# Altium project Driver Controller Tester.PrjPcb
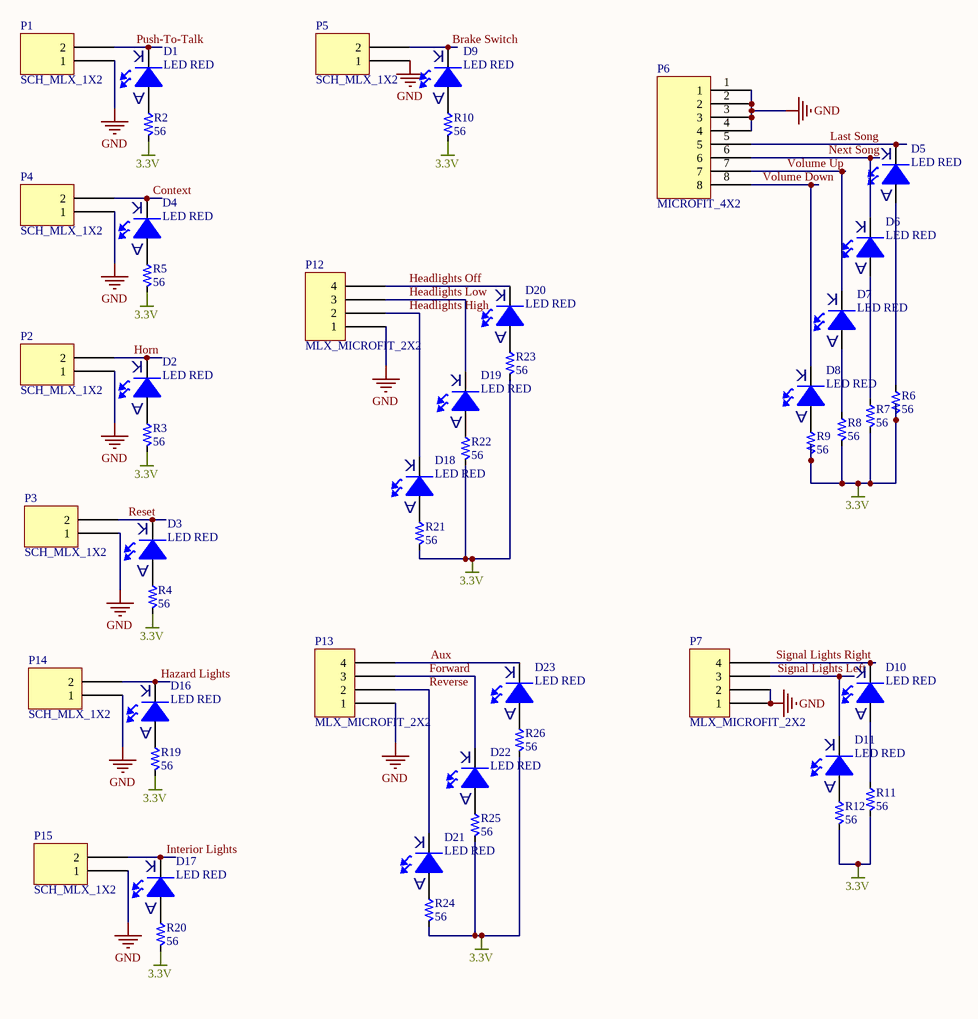
[diagram p0: Connectors.SchDoc]
2 sheets, 69 parts. Net scope: global (net labels, ports and power ports of the same name join across sheets).
Board file: Driver Controller Tester.PcbDoc
Sheets:
  Connectors.SchDoc
  Driver Controller Tester.SchDoc

## Sheet Connectors.SchDoc
size Letter

### Parts
D1  LED RED  [RED LED]
D2  LED RED  [RED LED]
D3  LED RED  [RED LED]
D4  LED RED  [RED LED]
D5  LED RED  [RED LED]
D6  LED RED  [RED LED]
D7  LED RED  [RED LED]
D8  LED RED  [RED LED]
D9  LED RED  [RED LED]
D10  LED RED  [RED LED]
D11  LED RED  [RED LED]
D16  LED RED  [RED LED]
D17  LED RED  [RED LED]
D18  LED RED  [RED LED]
D19  LED RED  [RED LED]
D20  LED RED  [RED LED]
D21  LED RED  [RED LED]
D22  LED RED  [RED LED]
D23  LED RED  [RED LED]
P1  SCH_MLX_1X2  [PCB_MLX_MICROFIT_1X2]
P2  SCH_MLX_1X2  [PCB_MLX_MICROFIT_1X2]
P3  SCH_MLX_1X2  [PCB_MLX_MICROFIT_1X2]
P4  SCH_MLX_1X2  [PCB_MLX_MICROFIT_1X2]
P5  SCH_MLX_1X2  [PCB_MLX_MICROFIT_1X2]
P6  MICROFIT_4X2  [PCB_MLX_MICROFIT_4X2]
P7  MLX_MICROFIT_2X2  [MLX_MICROFIT_2X2]
P12  MLX_MICROFIT_2X2  [MLX_MICROFIT_2X2]
P13  MLX_MICROFIT_2X2  [MLX_MICROFIT_2X2]
P14  SCH_MLX_1X2  [PCB_MLX_MICROFIT_1X2]
P15  SCH_MLX_1X2  [PCB_MLX_MICROFIT_1X2]
R2  Resistance: 56  [PCB_GENERIC_SMD_0603]  (hidden comment: SCH_GENERIC_RESISTOR_0603)
R3  Resistance: 56  [PCB_GENERIC_SMD_0603]  (hidden comment: SCH_GENERIC_RESISTOR_0603)
R4  Resistance: 56  [PCB_GENERIC_SMD_0603]  (hidden comment: SCH_GENERIC_RESISTOR_0603)
R5  Resistance: 56  [PCB_GENERIC_SMD_0603]  (hidden comment: SCH_GENERIC_RESISTOR_0603)
R6  Resistance: 56  [PCB_GENERIC_SMD_0603]  (hidden comment: SCH_GENERIC_RESISTOR_0603)
R7  Resistance: 56  [PCB_GENERIC_SMD_0603]  (hidden comment: SCH_GENERIC_RESISTOR_0603)
R8  Resistance: 56  [PCB_GENERIC_SMD_0603]  (hidden comment: SCH_GENERIC_RESISTOR_0603)
R9  Resistance: 56  [PCB_GENERIC_SMD_0603]  (hidden comment: SCH_GENERIC_RESISTOR_0603)
R10  Resistance: 56  [PCB_GENERIC_SMD_0603]  (hidden comment: SCH_GENERIC_RESISTOR_0603)
R11  Resistance: 56  [PCB_GENERIC_SMD_0603]  (hidden comment: SCH_GENERIC_RESISTOR_0603)
R12  Resistance: 56  [PCB_GENERIC_SMD_0603]  (hidden comment: SCH_GENERIC_RESISTOR_0603)
R19  Resistance: 56  [PCB_GENERIC_SMD_0603]  (hidden comment: SCH_GENERIC_RESISTOR_0603)
R20  Resistance: 56  [PCB_GENERIC_SMD_0603]  (hidden comment: SCH_GENERIC_RESISTOR_0603)
R21  Resistance: 56  [PCB_GENERIC_SMD_0603]  (hidden comment: SCH_GENERIC_RESISTOR_0603)
R22  Resistance: 56  [PCB_GENERIC_SMD_0603]  (hidden comment: SCH_GENERIC_RESISTOR_0603)
R23  Resistance: 56  [PCB_GENERIC_SMD_0603]  (hidden comment: SCH_GENERIC_RESISTOR_0603)
R24  Resistance: 56  [PCB_GENERIC_SMD_0603]  (hidden comment: SCH_GENERIC_RESISTOR_0603)
R25  Resistance: 56  [PCB_GENERIC_SMD_0603]  (hidden comment: SCH_GENERIC_RESISTOR_0603)
R26  Resistance: 56  [PCB_GENERIC_SMD_0603]  (hidden comment: SCH_GENERIC_RESISTOR_0603)

### Nets
3.3V: R2.2 R3.2 R4.2 R5.2 R6.2 R7.2 R8.2 R9.2 R10.2 R11.2 R12.2 R19.2 R20.2 R21.2 R22.2 R23.2 R24.2 R25.2 R26.2
GND: P1.1 P2.1 P3.1 P4.1 P5.1 P6.1 P6.2 P6.3 P6.4 P7.1 P7.2 P12.1 P13.1 P14.1 P15.1
Aux: D23.1 P13.4
Brake Switch: D9.1 P5.2
Context: D4.1 P4.2
Forward: D22.1 P13.3
Hazard Lights: D16.1 P14.2
Headlights High: D18.1 P12.2
Headlights Low: D19.1 P12.3
Headlights Off: D20.1 P12.4
Horn: D2.1 P2.2
Interior Lights: D17.1 P15.2
Last Song: D5.1 P6.5
Next Song: D6.1 P6.6
Push-To-Talk: D1.1 P1.2
Reset: D3.1 P3.2
Reverse: D21.1 P13.2
Signal Lights Left: D11.1 P7.3
Signal Lights Right: D10.1 P7.4
Volume Down: D8.1 P6.8
Volume Up: D7.1 P6.7
NetD1_2: D1.2 R2.1
NetD2_2: D2.2 R3.1
NetD3_2: D3.2 R4.1
NetD4_2: D4.2 R5.1
NetD5_2: D5.2 R6.1
NetD6_2: D6.2 R7.1
NetD7_2: D7.2 R8.1
NetD8_2: D8.2 R9.1
NetD9_2: D9.2 R10.1
NetD10_2: D10.2 R11.1
NetD11_2: D11.2 R12.1
NetD16_2: D16.2 R19.1
NetD17_2: D17.2 R20.1
NetD18_2: D18.2 R21.1
NetD19_2: D19.2 R22.1
NetD20_2: D20.2 R23.1
NetD21_2: D21.2 R24.1
NetD22_2: D22.2 R25.1
NetD23_2: D23.2 R26.1

### Library data of the parts
P6 = SCH_MLX_MICROFIT_4X2: Molex Microfit Connector 4x2
R2-R12 R19-R26 = SCH_GENERIC_RESISTOR_0603: Generic SMD resistor 0603

## Sheet Driver Controller Tester.SchDoc
size Letter
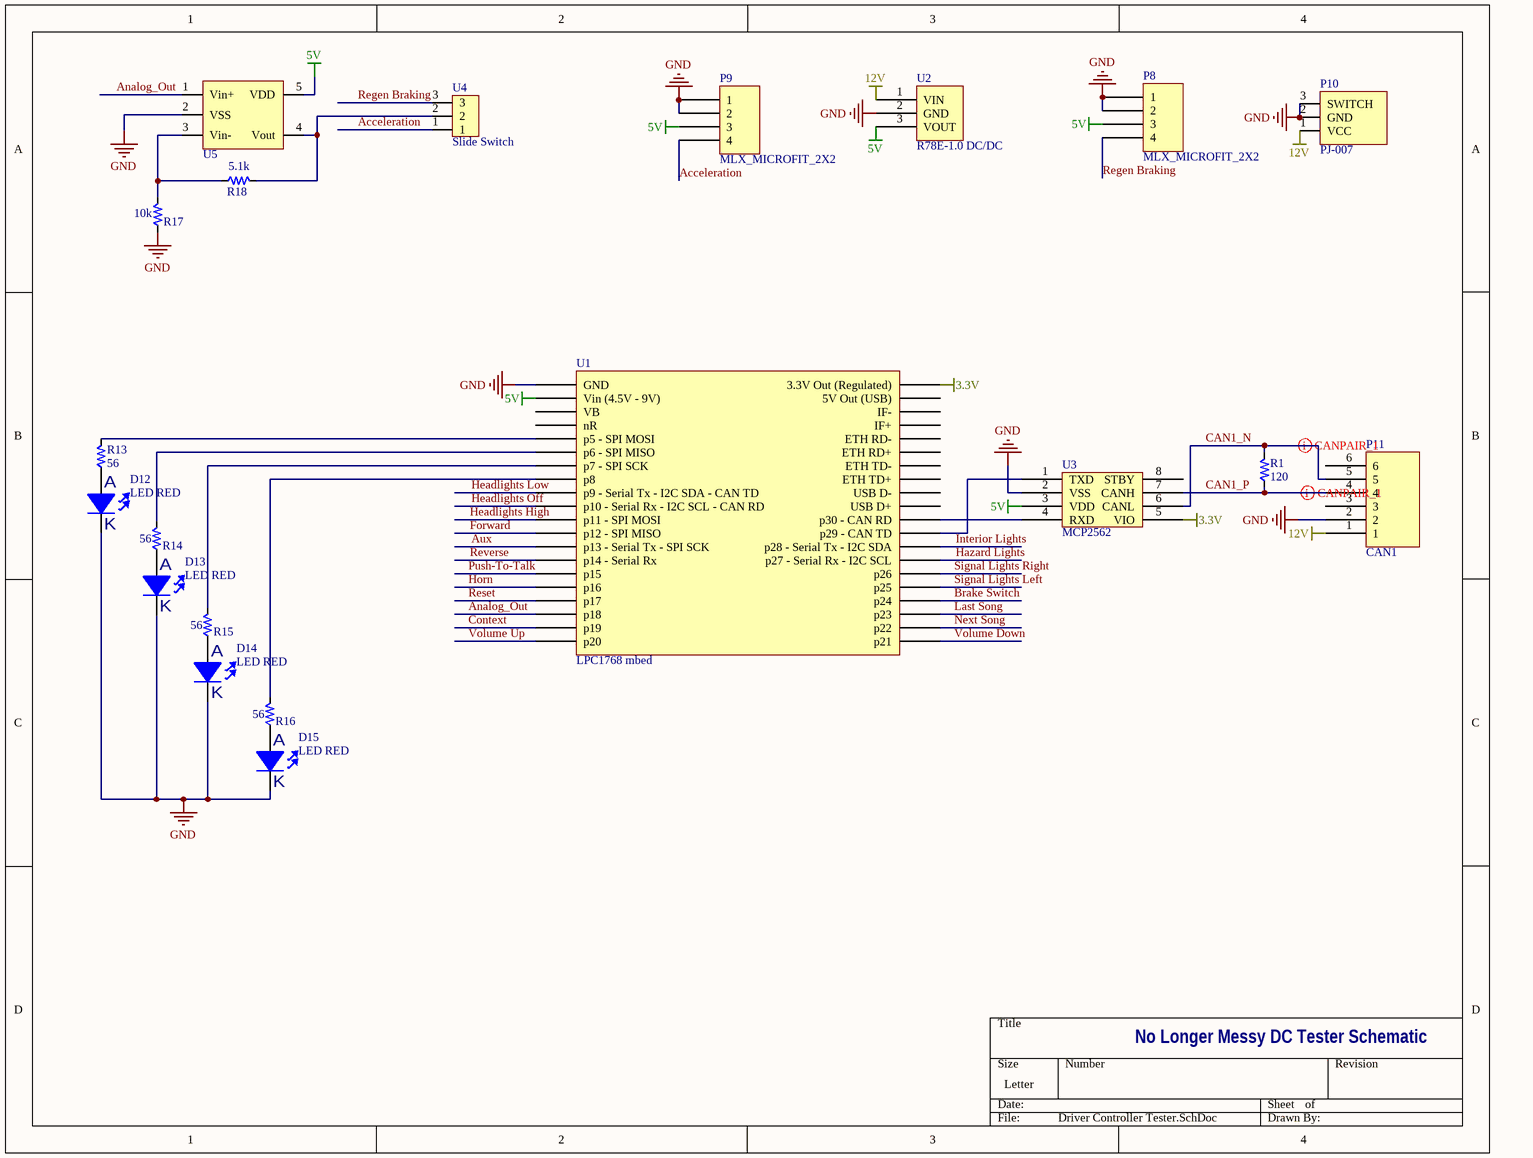
[diagram p1: Driver Controller Tester.SchDoc]

### Parts
D12  LED RED  [RED LED]
D13  LED RED  [RED LED]
D14  LED RED  [RED LED]
D15  LED RED  [RED LED]
P8  MLX_MICROFIT_2X2  [MLX_MICROFIT_2X2]
P9  MLX_MICROFIT_2X2  [MLX_MICROFIT_2X2]
P10  PJ-007  [BARREL JACK PJ007]
P11  CAN1  [PCB_MLX_MICROFIT_3X2]
R1  120  [PCB_GENERIC_SMD_0603]
R13  Resistance: 56  [PCB_GENERIC_SMD_0603]  (hidden comment: SCH_GENERIC_RESISTOR_0603)
R14  Resistance: 56  [PCB_GENERIC_SMD_0603]  (hidden comment: SCH_GENERIC_RESISTOR_0603)
R15  Resistance: 56  [PCB_GENERIC_SMD_0603]  (hidden comment: SCH_GENERIC_RESISTOR_0603)
R16  Resistance: 56  [PCB_GENERIC_SMD_0603]  (hidden comment: SCH_GENERIC_RESISTOR_0603)
R17  Resistance: 10k  [PCB_GENERIC_SMD_0603]  (hidden comment: SCH_GENERIC_RESISTOR_0603)
R18  Resistance: 5.1k  [PCB_GENERIC_SMD_0603]  (hidden comment: SCH_GENERIC_RESISTOR_0603)
U1  LPC1768 mbed  [LPC 1768 mbed Layout]
U2  R78E-1.0 DC/DC  [R78-1.0]
U3  MCP2562  [MCP2562]
U4  Slide Switch  [Slide Switch]
U5  MCP6001U  [MCP6001UT]  (value not drawn)

### Nets
3.3V: U1.40(3.3V_Out_(Regulated)) U3.5(VIO)
5V: P8.3 P9.3 U1.2(Vin_(4.5V_-_9V)) U2.3(VOUT) U3.3(VDD) U5.5(VDD)
12V: P10.1(VCC) P11.1 U2.1(VIN)
GND: D12.1 D13.1 D14.1 D15.1 P8.1 P8.2 P9.1 P9.2 P10.2(GND) P10.3(SWITCH) P11.2 R17.1 U1.1(GND) U2.2(GND) U3.2(VSS) U5.2(VSS)
Acceleration: P9.4 U4.1
Analog_Out: U1.18(p18) U5.1(Vin+)
Aux: U1.13(p13_-_Serial_Tx_-_SPI_SCK)
Brake Switch: U1.24(p24)
CAN1_N: P11.5 R1.2 U3.6(CANL)
CAN1_P: P11.4 R1.1 U3.7(CANH)
Context: U1.19(p19)
Forward: U1.12(p12_-_SPI_MISO)
Hazard Lights: U1.27(p27_-_Serial_Rx_-_I2C_SCL)
Headlights High: U1.11(p11_-_SPI_MOSI)
Headlights Low: U1.9(p9_-_Serial_Tx_-_I2C_SDA_-_CAN_TD)
Headlights Off: U1.10(p10_-_Serial_Rx_-_I2C_SCL_-_CAN_RD)
Horn: U1.16(p16)
Interior Lights: U1.28(p28_-_Serial_Tx_-_I2C_SDA)
Last Song: U1.23(p23)
Next Song: U1.22(p22)
Push-To-Talk: U1.15(p15)
Regen Braking: P8.4 U4.3
Reset: U1.17(p17)
Reverse: U1.14(p14_-_Serial_Rx)
Signal Lights Left: U1.25(p25)
Signal Lights Right: U1.26(p26)
Volume Down: U1.21(p21)
Volume Up: U1.20(p20)
NetD12_2: D12.2 R13.1
NetD13_2: D13.2 R14.1
NetD14_2: D14.2 R15.1
NetD15_2: D15.2 R16.1
NetR13_2: R13.2 U1.5(p5_-_SPI_MOSI)
NetR14_2: R14.2 U1.6(p6_-_SPI_MISO)
NetR15_2: R15.2 U1.7(p7_-_SPI_SCK)
NetR16_2: R16.2 U1.8(p8)
NetR17_2: R17.2 R18.1 U5.3(Vin-)
NetR18_2: R18.2 U4.2 U5.4(Vout)
NetU1_29: U1.29(p29_-_CAN_TD) U3.1(TXD)
NetU1_30: U1.30(p30_-_CAN_RD) U3.4(RXD)

Not connected (* = marked no-connect by the designer): P11 3 6; U1 3(VB) 4(nR) 31(USB_D+) 32(USB_D-) 33(ETH_TD+) 34(ETH_TD-) 35(ETH_RD+) 36(ETH_RD-) 37(IF+) 38(IF-) 39(5V_Out_(USB)); U3 8(STBY)

### Layout directives
differential pair: CAN1_N, CAN1_P

### Notes on the sheet
- No Longer Messy DC Tester Schematic
- (in symbol LED RED) A; K

### Library data of the parts
P10 = Component_1
P11 = SCH_MLX_MICROFIT_3X2
R1 = SCH_GENERIC_RESISTOR_0603: 120 Ohms; Resistance: 120
R13-R18 = SCH_GENERIC_RESISTOR_0603: Generic SMD resistor 0603
U2 = R78E-1.0

## Nets that join several sheets
3.3V: Connectors (19 pins), Driver Controller Tester (U1.40 U3.5)
GND: Connectors (15 pins), Driver Controller Tester (16 pins)
Aux: Connectors (D23.1 P13.4), Driver Controller Tester (U1.13)
Brake Switch: Connectors (D9.1 P5.2), Driver Controller Tester (U1.24)
Context: Connectors (D4.1 P4.2), Driver Controller Tester (U1.19)
Forward: Connectors (D22.1 P13.3), Driver Controller Tester (U1.12)
Hazard Lights: Connectors (D16.1 P14.2), Driver Controller Tester (U1.27)
Headlights High: Connectors (D18.1 P12.2), Driver Controller Tester (U1.11)
Headlights Low: Connectors (D19.1 P12.3), Driver Controller Tester (U1.9)
Headlights Off: Connectors (D20.1 P12.4), Driver Controller Tester (U1.10)
Horn: Connectors (D2.1 P2.2), Driver Controller Tester (U1.16)
Interior Lights: Connectors (D17.1 P15.2), Driver Controller Tester (U1.28)
Last Song: Connectors (D5.1 P6.5), Driver Controller Tester (U1.23)
Next Song: Connectors (D6.1 P6.6), Driver Controller Tester (U1.22)
Push-To-Talk: Connectors (D1.1 P1.2), Driver Controller Tester (U1.15)
Reset: Connectors (D3.1 P3.2), Driver Controller Tester (U1.17)
Reverse: Connectors (D21.1 P13.2), Driver Controller Tester (U1.14)
Signal Lights Left: Connectors (D11.1 P7.3), Driver Controller Tester (U1.25)
Signal Lights Right: Connectors (D10.1 P7.4), Driver Controller Tester (U1.26)
Volume Down: Connectors (D8.1 P6.8), Driver Controller Tester (U1.21)
Volume Up: Connectors (D7.1 P6.7), Driver Controller Tester (U1.20)